# Altium schematic sheet MainBoard_Motor3.SchDoc
size A3
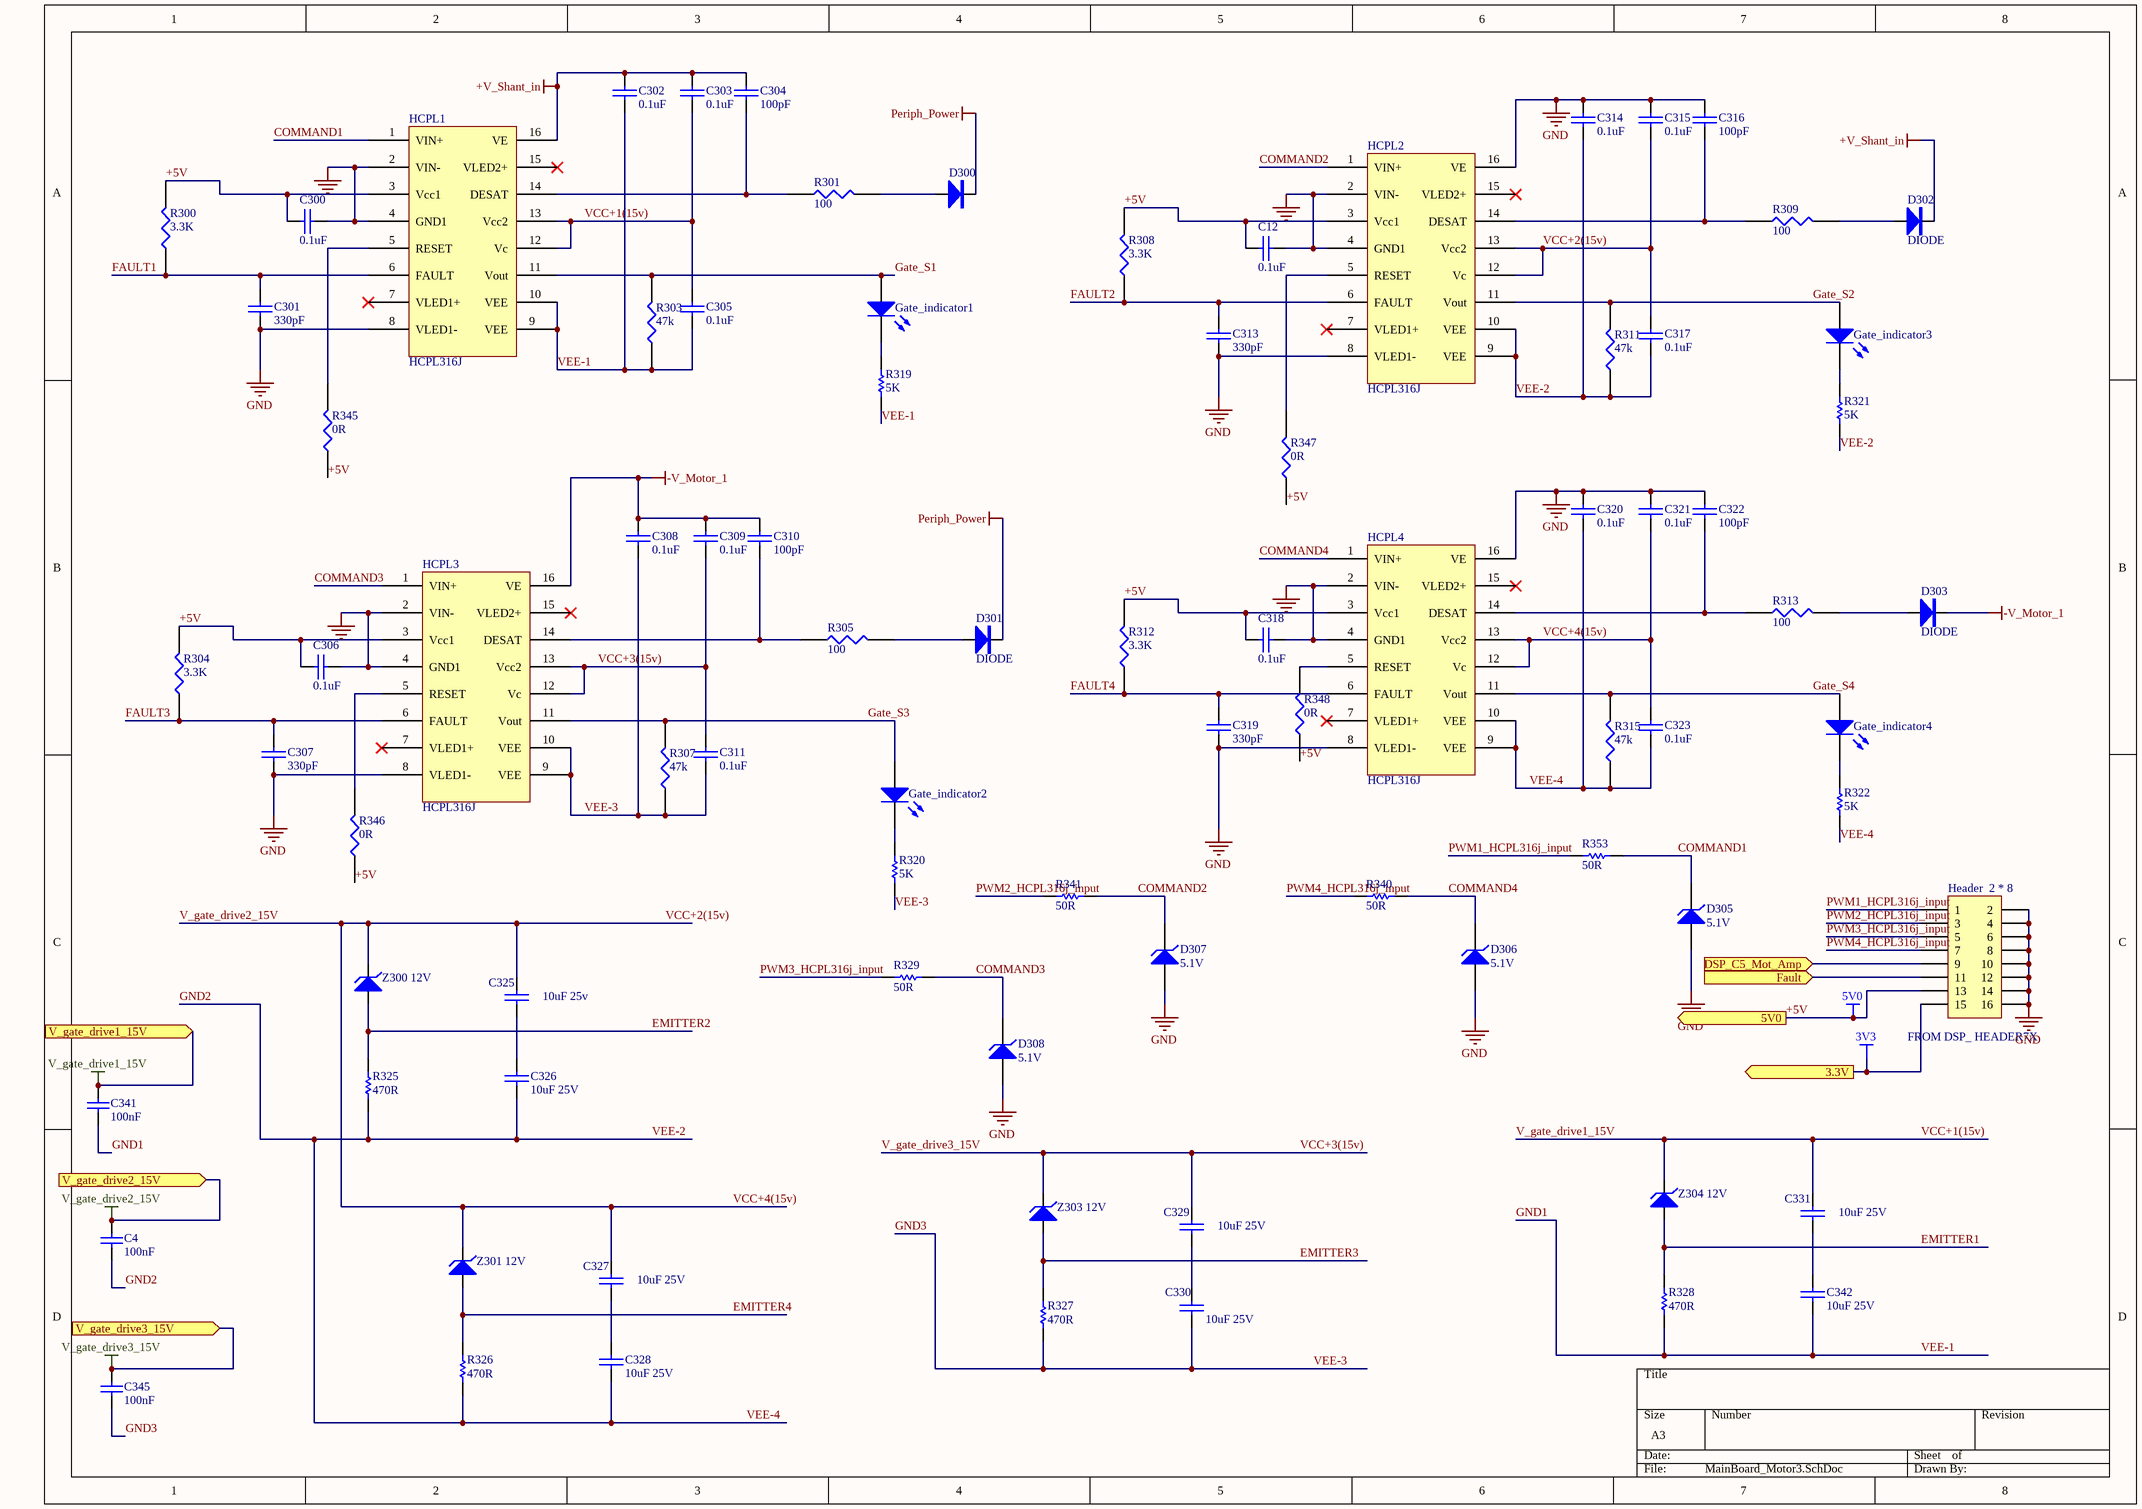
[diagram p0: MainBoard_Motor3.SchDoc]

## Parts
C4  100nF  [C0603]
C12  0.1uF  [1206]
C300  0.1uF  [1206]
C301  330pF  [1206]
C302  0.1uF  [1206]
C303  0.1uF  [1206]
C304  100pF  [1206]
C305  0.1uF  [1206]
C306  0.1uF  [1206]
C307  330pF  [1206]
C308  0.1uF  [1206]
C309  0.1uF  [1206]
C310  100pF  [1206]
C311  0.1uF  [1206]
C313  330pF  [1206]
C314  0.1uF  [1206]
C315  0.1uF  [1206]
C316  100pF  [1206]
C317  0.1uF  [1206]
C318  0.1uF  [1206]
C319  330pF  [1206]
C320  0.1uF  [1206]
C321  0.1uF  [1206]
C322  100pF  [1206]
C323  0.1uF  [1206]
C325  10uF 25v  [CAPACITOR0.1]
C326  10uF 25V  [CAPACITOR0.1]
C327  10uF 25V  [CAPACITOR0.1]
C328  10uF 25V  [CAPACITOR0.1]
C329  10uF 25V  [CAPACITOR0.1]
C330  10uF 25V  [CAPACITOR0.1]
C331  10uF 25V  [CAPACITOR0.1]
C341  100nF  [C0603]
C342  10uF 25V  [CAPACITOR0.1]
C345  100nF  [C0603]
D300  (no value)  [DIODEE]
D301  DIODE  [DIODEE]
D302  DIODE  [DIODEE]
D303  DIODE  [DIODEE]
D305  5.1V  [DO-214AC-PW]
D306  5.1V  [DO-214AC-PW]
D307  5.1V  [DO-214AC-PW]
D308  5.1V  [DO-214AC-PW]
Gate_indicator1  GREEN  [LED_0805_GREEN]  (value not drawn)
Gate_indicator2  GREEN  [LED_0805_GREEN]  (value not drawn)
Gate_indicator3  GREEN  [LED_0805_GREEN]  (value not drawn)
Gate_indicator4  GREEN  [LED_0805_GREEN]  (value not drawn)
HCPL1  HCPL316J  [SO-G16/G6.9]
HCPL2  HCPL316J  [SO-G16/G6.9]
HCPL3  HCPL316J  [SO-G16/G6.9]
HCPL4  HCPL316J  [SO-G16/G6.9]
Header_2_*_8  FROM DSP_ HEADER7X  [HDR2X8]
R300  3.3K  [1206]
R301  100  [1206]
R303  47k  [1206]
R304  3.3K  [1206]
R305  100  [1206]
R307  47k  [1206]
R308  3.3K  [1206]
R309  100  [1206]
R311  47k  [1206]
R312  3.3K  [1206]
R313  100  [1206]
R315  47k  [1206]
R319  5K  [R0603]
R320  5K  [R0603]
R321  5K  [R0603]
R322  5K  [R0603]
R325  470R  [R1206]
R326  470R  [R1206]
R327  470R  [R1206]
R328  470R  [R1206]
R329  50R  [R0805]
R340  50R  [R1206]
R341  50R  [R1206]
R345  0R  [1206]
R346  0R  [1206]
R347  0R  [1206]
R348  0R  [1206]
R353  50R  [R1206]
Z300_12V  (no value)  [DIODEE]
Z301_12V  (no value)  [DIODEE]
Z303_12V  (no value)  [DIODEE]
Z304_12V  (no value)  [DIODEE]

## Ports
3.3V (out), 5V0 (out), DSP_C5_Mot_Amp (in), Fault (in), V_gate_drive1_15V (in), V_gate_drive2_15V (in), V_gate_drive3_15V (in)

## Nets
3V3: Header_2_*_8.15 ; port 3.3V
+5V: C12.1 C300.1 C306.1 C318.1 HCPL1.3(Vcc1) HCPL2.3(Vcc1) HCPL3.3(Vcc1) HCPL4.3(Vcc1) Header_2_*_8.13 R300.2 R304.2 R308.2 R312.2 R345.1 R346.1 R347.1 R348.1 ; port 5V0  [also labelled 5V0]
+V_Shant_in: C302.1 C303.1 C304.1 D302.2(K) HCPL1.16(VE)
-V_Motor_1: C308.1 C309.1 C310.1 D303.2(K) HCPL3.16(VE)
GND: C12.2 C300.2 C301.2 C306.2 C307.2 C313.2 C314.1 C315.1 C316.1 C318.2 C319.2 C320.1 C321.1 C322.1 D305.1(A) D306.1(A) D307.1(A) D308.1(A) HCPL1.2(VIN-) HCPL1.4(GND1) HCPL1.8(VLED1-) HCPL2.2(VIN-) HCPL2.4(GND1) HCPL2.8(VLED1-) HCPL2.16(VE) HCPL3.2(VIN-) HCPL3.4(GND1) HCPL3.8(VLED1-) HCPL4.2(VIN-) HCPL4.4(GND1) HCPL4.8(VLED1-) HCPL4.16(VE) Header_2_*_8.2 Header_2_*_8.4 Header_2_*_8.6 Header_2_*_8.8 Header_2_*_8.10 Header_2_*_8.12 Header_2_*_8.14 Header_2_*_8.16
Periph_Power: D300.2(K) D301.2(K)
V_gate_drive1_15V: C303.2 C305.1 C331.1 C341.2 HCPL1.12(Vc) HCPL1.13(Vcc2) Z304_12V.2(K) ; port V_gate_drive1_15V  [also labelled VCC+1(15v)]
V_gate_drive2_15V: C4.2 C315.2 C317.1 C321.2 C323.1 C325.1 C327.1 HCPL2.12(Vc) HCPL2.13(Vcc2) HCPL4.12(Vc) HCPL4.13(Vcc2) Z300_12V.2(K) Z301_12V.2(K) ; port V_gate_drive2_15V  [also labelled VCC+2(15v), VCC+4(15v)]
V_gate_drive3_15V: C309.2 C311.1 C329.1 C345.2 HCPL3.12(Vc) HCPL3.13(Vcc2) Z303_12V.2(K) ; port V_gate_drive3_15V  [also labelled VCC+3(15v)]
COMMAND1: D305.2(K) HCPL1.1(VIN+) R353.2
COMMAND2: D307.2(K) HCPL2.1(VIN+) R341.2
COMMAND3: D308.2(K) HCPL3.1(VIN+) R329.2
COMMAND4: D306.2(K) HCPL4.1(VIN+) R340.2
DSP_C5_Mot_Amp: Header_2_*_8.9 ; port DSP_C5_Mot_Amp
EMITTER1: R328.2 Z304_12V.1(A)
EMITTER2: R325.2 Z300_12V.1(A)
EMITTER3: R327.2 Z303_12V.1(A)
EMITTER4: R326.2 Z301_12V.1(A)
Fault: Header_2_*_8.11 ; port Fault
FAULT1: C301.1 HCPL1.6(FAULT) R300.1
FAULT2: C313.1 HCPL2.6(FAULT) R308.1
FAULT3: C307.1 HCPL3.6(FAULT) R304.1
FAULT4: C319.1 HCPL4.6(FAULT) R312.1
Gate_S1: Gate_indicator1.1(A) HCPL1.11(Vout) R303.2
Gate_S2: Gate_indicator3.1(A) HCPL2.11(Vout) R311.2
Gate_S3: Gate_indicator2.1(A) HCPL3.11(Vout) R307.2
Gate_S4: Gate_indicator4.1(A) HCPL4.11(Vout) R315.2
GND1: C302.2 C305.2 C341.1 C342.2 HCPL1.9(VEE) HCPL1.10(VEE) R303.1 R319.1 R328.1  [also labelled VEE-1]
GND2: C4.1 C314.2 C317.2 C320.2 C323.2 C326.2 C328.2 HCPL2.9(VEE) HCPL2.10(VEE) HCPL4.9(VEE) HCPL4.10(VEE) R311.1 R315.1 R321.1 R322.1 R325.1 R326.1  [also labelled VEE-2, VEE-4]
GND3: C308.2 C311.2 C330.2 C345.1 HCPL3.9(VEE) HCPL3.10(VEE) R307.1 R320.1 R327.1  [also labelled VEE-3]
PWM1_HCPL316j_input: Header_2_*_8.1 R353.1
PWM2_HCPL316j_input: Header_2_*_8.3 R341.1
PWM3_HCPL316j_input: Header_2_*_8.5 R329.1
PWM4_HCPL316j_input: Header_2_*_8.7 R340.1
NetC304_2: C304.2 HCPL1.14(DESAT) R301.1
NetC310_2: C310.2 HCPL3.14(DESAT) R305.1
NetC316_2: C316.2 HCPL2.14(DESAT) R309.1
NetC322_2: C322.2 HCPL4.14(DESAT) R313.1
NetC325_2: C325.2 C326.1
NetC327_2: C327.2 C328.1
NetC329_2: C329.2 C330.1
NetC331_2: C331.2 C342.1
NetD300_1: D300.1(A) R301.2
NetD301_1: D301.1(A) R305.2
NetD302_1: D302.1(A) R309.2
NetD303_1: D303.1(A) R313.2
NetGate_indicator1_2: Gate_indicator1.2(K) R319.2
NetGate_indicator2_2: Gate_indicator2.2(K) R320.2
NetGate_indicator3_2: Gate_indicator3.2(K) R321.2
NetGate_indicator4_2: Gate_indicator4.2(K) R322.2
NetHCPL1_5: HCPL1.5(RESET) R345.2
NetHCPL2_5: HCPL2.5(RESET) R347.2
NetHCPL3_5: HCPL3.5(RESET) R346.2
NetHCPL4_5: HCPL4.5(RESET) R348.2

Not connected (* = marked no-connect by the designer): HCPL1 7(VLED1+)* 15(VLED2+)*; HCPL2 7(VLED1+)* 15(VLED2+)*; HCPL3 7(VLED1+)* 15(VLED2+)*; HCPL4 7(VLED1+)* 15(VLED2+)*

## Library data of the parts
C4 C341 C345 = Cap_100nF_50V_0603: Cap_100nF_10%_X7R_50V_0603; Manufacturer: Yageo; MFR PART NO: CC0603KPX7R9BB104; SAP: 10021427
C12 C300 C302 C303 C305 C306 C308 C309 C311 C314 C315 C317 C318 C320 C321 C323 = CAP: Cap_0.1uF_10%_X7R_50V_0805
C301 C307 C313 C319 = CAP: Cap_330pF_10%_X7R_50V_0805
C304 C310 C316 C322 = CAP: Cap_100pF_10%_X7R_50V_0805
C325-C331 C342 = CAP: Capacitor
D300 = 100HF100PV: Diode
D305-D308 = D Zener: DIODE ZENER 5V 1.25W DO214AC; MFR PART NO: BZG05C3V3; Manufacturer: ON Semiconductor; Published: 8-Jun-2000; LatestRevisionDate: 17-Jul-2002; LatestRevisionNote: Re-released for DXP Platform.; PackageReference: DIODE-0.7; Publisher: Altium Limited; PackageDescription: Diode, Thru-Hole; 2 Leads; 0.7 in Pin Spacing
Gate_indicator1-Gate_indicator4 = LED3: Typical BLUE SiC LED; Manufacturer: Kingbright; MFR PART NO: APT2012SGC; Published: 8-Jun-2000; LatestRevisionDate: 17-Dec-2003; LatestRevisionNote: PCB Footprint replaced.; DatasheetVersion: 16-Apr-2002; PackageVersion: 16-Apr-2002; PackageReference: 3.5X2.8X1.9; Publisher: Altium Limited; PackageDescription: SM LED; 2 C-Bend Leads; Body 3.5 x 2.8 x 1.9 mm, inc leads (LxWxH typ); Value: GREEN
Header_2_*_8 = Header 8X2: Header, 8-Pin, Dual row; LatestRevisionDate: 17-Jul-2002; LatestRevisionNote: Re-released for DXP Platform.; Publisher: Altium Limited
R300 R304 R308 R312 = RES1: Res_3.3k_1%_0.25W_805
R301 R309 = RES1: Res_100R_1%_0.25W_1206
R303 R307 R311 = RES1: Res_47k_1%_0.25W_1206
R305 R313 R315 = RES1
R319-R322 = Res_3.3K_0603: Res_3.3K_1%_0603; Manufacturer: Yageo; MFR PART NO: RC0603FR-073K3L; SAP: 10016022
R325-R328 R340 R341 R353 = Res_20R_1206: Res_20R_1%_0.25W_1206; Manufacturer: Yageo; MFR PART NO: RC1206FR-0720RL; SAP: 10021877
R329 = Res_4.7K_0805: Res_4.7K_1%_0805; Manufacturer: Yageo; MFR PART NO: RC0805FR-074K7L; SAP: 10021870
R345-R348 = RES1: Res_0 ohm_1%_0.25W_805
Z300_12V Z301_12V Z303_12V Z304_12V = 1N4728: Zener Diode